# EAGLE design seitanclock (EAGLE 7.7.0)
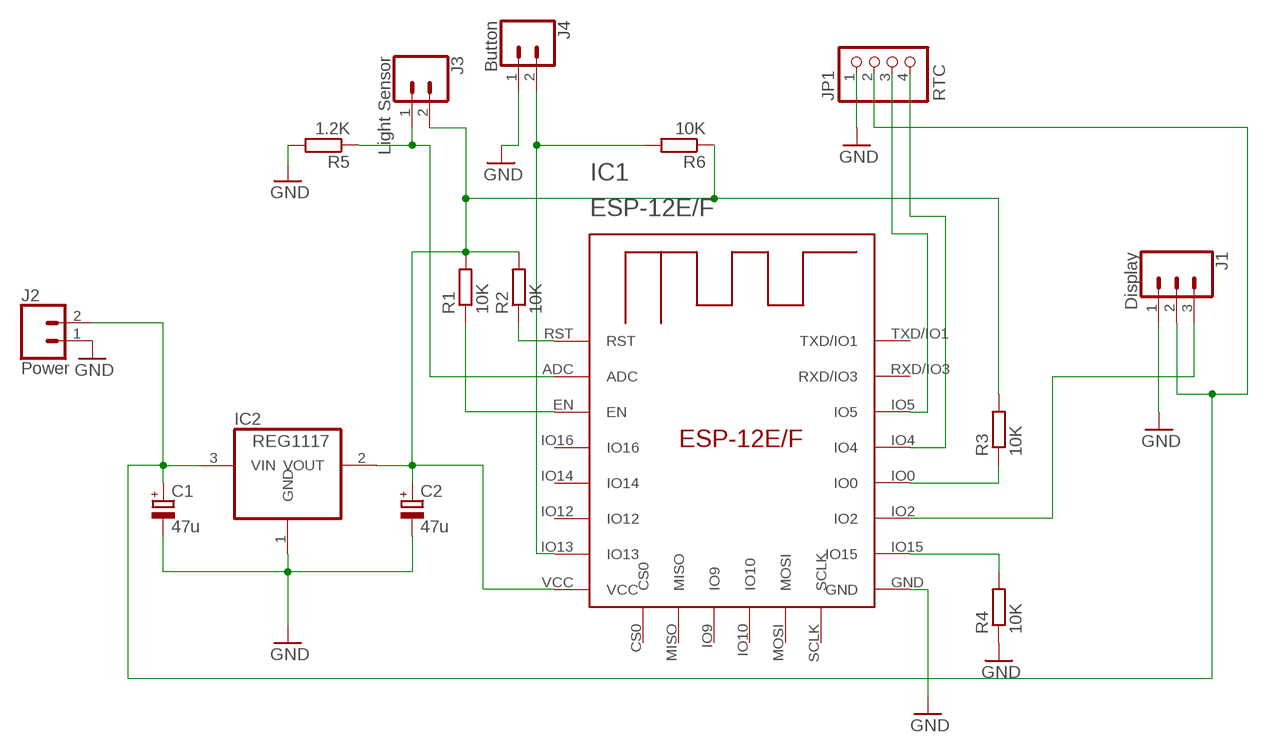
[diagram p0: schematic, sheet 1]

## Parts
C1  47u  CPOL-EU153CLV-0605  [153CLV-0605]
C2  47u  CPOL-EU153CLV-0605  [153CLV-0605]
IC1  ESP-12E/F  [ESP-12E]
IC2  REG1117  [SOT223]
J1  Display  CONN_03POLAR  [MOLEX-1X3]
J2  Power  CONN_02POLAR  [MOLEX-1X2]
J3  Light Sensor  CONN_02POLAR  [MOLEX-1X2]
J4  Button  CONN_02POLAR  [MOLEX-1X2]
JP1  RTC  PINHD-1X4  [1X04]
R1  10K  R-EU_R1206  [R1206]
R2  10K  R-EU_R1206  [R1206]
R3  10K  R-EU_R1206  [R1206]
R4  10K  R-EU_R1206  [R1206]
R5  1.2K  R-EU_R1206  [R1206]
R6  10K  R-EU_R1206  [R1206]

## Nets
GND: C1.- C2.- IC1.GND IC2.1(GND) J1.1 J2.1 J4.1 JP1.1 R4.1 R5.2
N$2: IC1.IO5 JP1.3
N$3: IC1.EN R1.1
N$4: IC1.RST R2.1
N$5: C2.+ IC1.VCC IC2.2(VOUT) J3.2 R1.2 R2.2 R3.2 R6.1
N$6: IC1.IO15 R4.2
N$7: IC1.IO0 R3.1
N$8: IC1.IO4 JP1.4
N$9: IC1.ADC J3.1 R5.1
N$10: IC1.IO2 J1.3
N$11: IC1.IO13 J4.2 R6.2
N$12: C1.+ IC2.3(VIN) J1.2 J2.2 JP1.2
Unconnected: IC1.CS0 IC1.IO9 IC1.IO10 IC1.IO12 IC1.IO14 IC1.IO16 IC1.MISO IC1.MOSI IC1.RXD/IO3 IC1.SCLK IC1.TXD/IO1

## Library data of the parts
C1 C2 = rcl:CPOL-EU: POLARIZED CAPACITOR, European symbol
IC1 = esp-12e-f:ESP-12E/F
IC2 = burr-brown:REG1117: 800mA and 1A Low Dropout (LDO) Positive Regulator 1.8V, 2.5V, 2.85V, 3.3V, 5V, and Adj; MPN: REG1117; OC_FARNELL: 1097566; OC_NEWARK: 14P6981
J1 = SparkFun-Connectors:CONN_03: Multi connection point. Often used as Generic Header-pin footprint for 0.1 inch spaced/style header connections On any of the 0.1 inch spaced packages, you can populate with these: Break Away Headers - Straight <https://www.sparkfun.com/products/116> (PRT-00116) Break Away Male Headers - Right Angle <https://www.sparkfun.com/products/553> (PRT-00553) Female Headers <https://www.sparkfun.com/products/115> (PRT-00115) Break Away Headers - Machine Pin <https://www.sparkfun.com/products/117> (PRT-00117) Break Away Female Headers - Swiss Machine Pin <https://www.sparkfun.com/products/743> (PRT-00743) Stackable Header - 3 Pin (Female, 0.1") <https://www.sparkfun.com/products/13875> (PRT-13875) For SCREWTERMINALS and SPRING TERMINALS visit here: Screw Terimnals on SparkFun.com <https://www.sparkfun.com/search/results?term=Screw+Terminals> (5mm/3.5mm/2.54mm spacing) This device is also useful as a general connection point to wire up your design to another part of your project. Our various solder wires solder well into these plated through hole pads. Hook-Up Wire - Assortment (Stranded, 22 AWG) <https://www.sparkfun.com/products/11375> (PRT-11375) Hook-Up Wire - Assortment (Solid Core, 22 AWG) <https://www.sparkfun.com/products/11367> (PRT-11367) View the entire wire category on our website here <https://www.sparkfun.com/categories/141> Special notes: Molex polarized connector foot print use with SKU : PRT-08232 with associated crimp pins and housings.; PROD_ID: CONN-08625; SF_ID: PRT-08096
J2-J4 = SparkFun-Connectors:CONN_02: Multi connection point. Often used as Generic Header-pin footprint for 0.1 inch spaced/style header connections On any of the 0.1 inch spaced packages, you can populate with these: Break Away Headers - Straight <https://www.sparkfun.com/products/116> (PRT-00116) Break Away Male Headers - Right Angle <https://www.sparkfun.com/products/553> (PRT-00553) Female Headers <https://www.sparkfun.com/products/115> (PRT-00115) Break Away Headers - Machine Pin <https://www.sparkfun.com/products/117> (PRT-00117) Break Away Female Headers - Swiss Machine Pin <https://www.sparkfun.com/products/743> (PRT-00743) For SCREWTERMINALS and SPRING TERMINALS visit here: Screw Terimnals on SparkFun.com <https://www.sparkfun.com/search/results?term=Screw+Terminals> (5mm/3.5mm/2.54mm spacing) This device is also useful as a general connection point to wire up your design to another part of your project. Our various solder wires solder well into these plated through hole pads. Hook-Up Wire - Assortment (Stranded, 22 AWG) <https://www.sparkfun.com/products/11375> (PRT-11375) Hook-Up Wire - Assortment (Solid Core, 22 AWG) <https://www.sparkfun.com/products/11367> (PRT-11367) View the entire wire category on our website here <https://www.sparkfun.com/categories/141> Special notes: Molex polarized connector foot print use with: PRT-08233 with associated crimp pins and housings. 2.54_SCREWTERM for use with PRT-10571. 3.5mm Screw Terminal footprints for PRT-08084 5mm Screw Terminal footprints for use with PRT-08432; SF_ID: PRT-09918
JP1 = pinhead:PINHD-1X4: PIN HEADER
R1-R6 = rcl:R-EU_: RESISTOR, European symbol

## Board
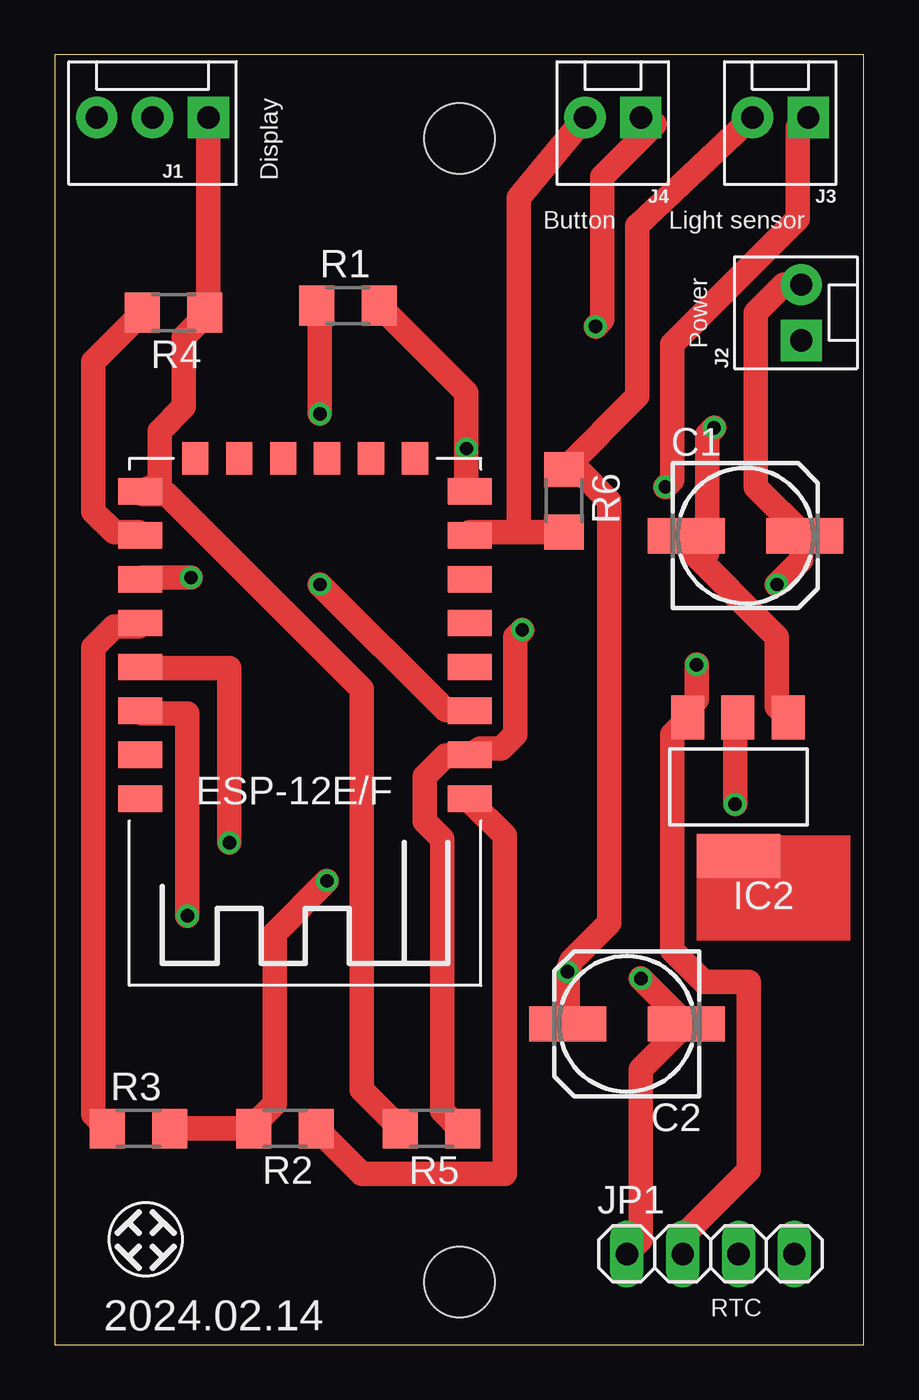
[diagram p1: board, top side]
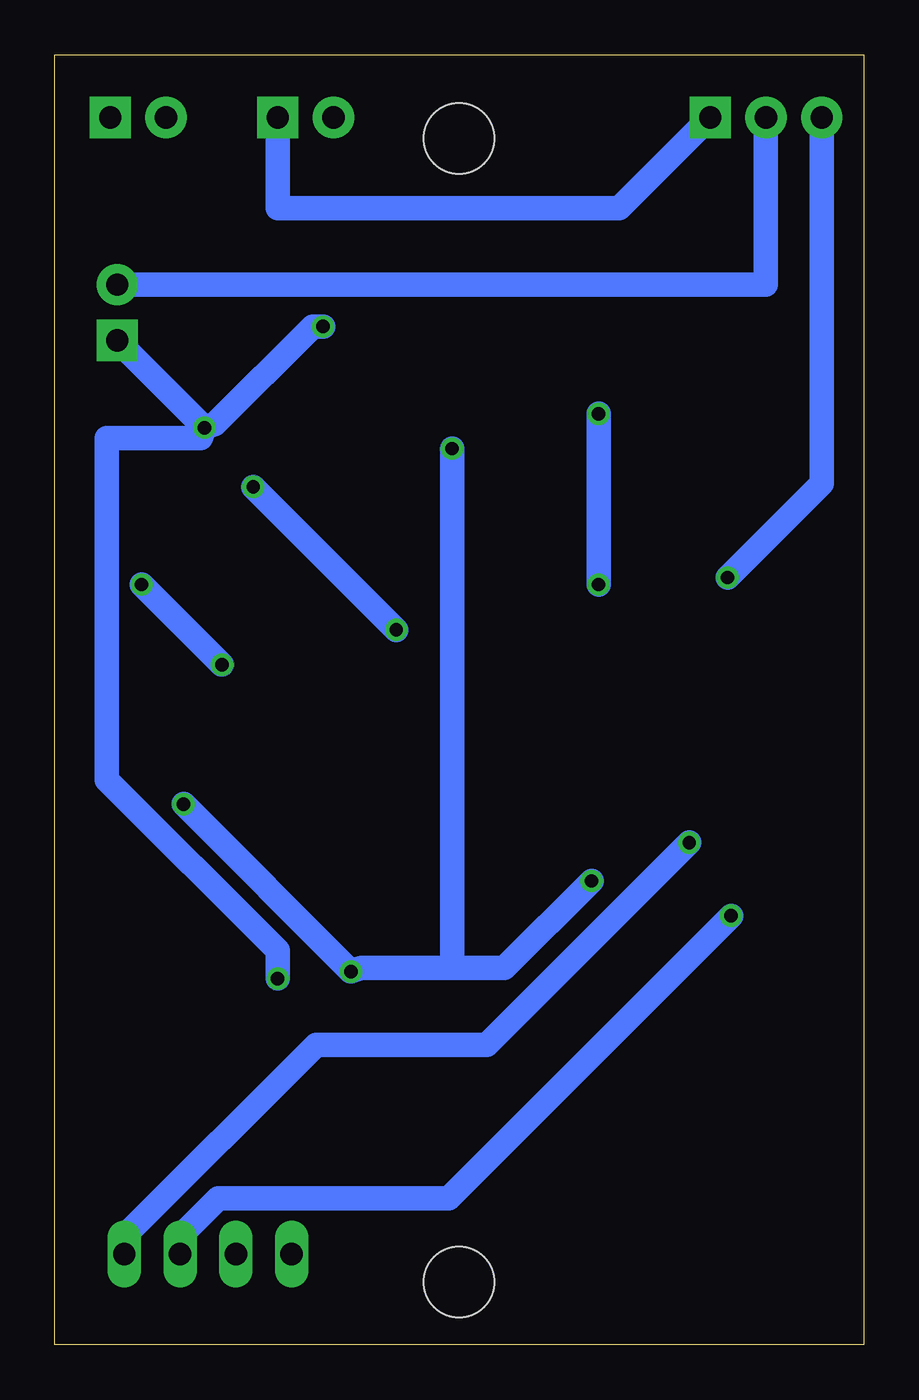
[diagram p2: board, bottom side, seen from below]

Size 36.81 x 58.73 mm. Coordinates in mm from the lower left corner, seen from the top.
Outline: 0,0 36.81,0 36.81,58.73 0,58.73 0,0
Copper layers (1*16): Top 0.035mm / dielectric 1.5mm / Bottom 0.035mm
Design rules "default *": minimum track width 44mil, minimum drill 24mil, track to track 18mil, track to pad 18mil, pad to pad 18mil, via to via 8mil, smd to smd 8mil, copper to edge 40mil, drill to drill 8mil, minimum pad ring 10mil, minimum via ring 8mil, stop-mask expansion 4mil, vias tented up to drill 0mil, thermal gap 10mil
Holes 3.2 mm at 18.41,54.93 18.41,2.86

### Footprints (pad centres in the part's own frame; a part is rotated, then mirrored left to right if it is on the bottom)
153CLV-0605 = smd 3.5 x 1.6: + 2.7,0; - -2.7,0
ESP-12E = smd 2 x 1.2: ADC -7.46,5.53; EN -7.46,3.53; GND 7.54,-6.47; IO0 7.54,-0.47; IO2 7.54,-2.47; IO4 7.54,1.53; IO5 7.54,3.53; IO12 -7.46,-2.47; IO13 -7.46,-4.47; IO14 -7.46,-0.47; IO15 7.54,-4.47; IO16 -7.46,1.53; RST -7.46,7.53; RXD/IO3 7.54,5.53; TXD/IO1 7.54,7.53; VCC -7.46,-6.47 | smd 1.2 x 1.5: CS0 -4.96,-7.97; IO9 -0.96,-7.97; IO10 1.04,-7.97; MISO -2.96,-7.97; MOSI 3.04,-7.97; SCLK 5.04,-7.97
SOT223 = smd 1.499 x 2.007: 1 -2.261,-3.15; 2 0.025,-3.15; 3 2.311,-3.15 | smd 3.81 x 2.007: 4 0,3.15
MOLEX-1X3 = drill 1.016 pad 1.88 square: 1 0,0 | drill 1.016 pad 1.88: 2 2.54,0; 3 5.08,0
MOLEX-1X2 = drill 1.016 pad 1.88 square: 1 0,0 | drill 1.016 pad 1.88: 2 2.54,0
1X04 = drill 1.016 long: 1 -3.81,0; 2 -1.27,0; 3 1.27,0; 4 3.81,0
R1206 = smd 1.6 x 1.803: 1 -1.422,0; 2 1.422,0

### Placement (x,y rotation side)
C1  31.43,36.83 0 top
C2  26.04,14.61 180 top
IC1  11.43,32.39 180 top
IC2  31.11,25.4 180 top
J1  6.99,55.88 180 top
J2  33.97,45.72 90 top
J3  34.29,55.88 180 top
J4  26.67,55.88 180 top
JP1  29.84,4.13 0 top
R1  13.34,47.31 0 top
R2  10.48,9.84 180 top
R3  3.81,9.84 0 top
R4  5.4,46.99 180 top
R5  17.14,9.84 180 top
R6  23.18,38.42 270 top
U$1  [SEITAN_TNAME]  4.76,4.13 0 top

### Tracks (layer width: path | path; a pad name or v marks a point on that pad's centre or on a via)
GND  (via drill 0.61)
  Top 1.118: JP1.1 26.67,4.76 26.67,12.54 C2.- 28.42,14.92 v26.67,16.67 | IC2.1 33.34,28.58 32.86,29.05 32.86,32.23 28.73,36.35 C1.- 29.69,36.04 29.69,41.43 v30,41.75 | J1.1 6.99,47.15 R4.1 6.51,46.51 5.87,45.88 5.87,42.7 4.76,41.59 4.76,39.21 IC1.GND 3.97,38.73 5.08,38.73 13.97,29.84 13.97,11.59 R5.2 | v24.61,46.36 24.92,46.67 24.92,53.18 27.3,55.56 J4.1
  Bottom 1.118: v30,41.75 J2.1 | v26.67,16.67 26.67,17.94 34.45,25.72 34.45,41.28 30.16,41.28 v30,41.75 | J4.1 26.67,51.75 11.11,51.75 J1.1 | v24.61,46.36 25.08,46.36 29.53,41.91 v30,41.75
N$2  (via drill 0.61)
  Top 1.118: v6.03,19.53 6.03,28.73 3.97,28.73 IC1.IO5
  Bottom 1.118: v6.03,19.53 18.89,6.67 29.37,6.67 31.11,4.92 JP1.3
N$3  (via drill 0.61)
  Top 1.118: v12.06,42.39 12.06,47.31 R1.1 | v12.06,34.61 17.78,28.89 18.73,28.89 IC1.EN
  Bottom 1.118: v12.06,34.61 v12.06,42.39
N$4
  Top 1.118: R2.1 13.97,7.78 20.48,7.78 20.48,23.18 18.89,24.77 IC1.RST
N$5  (via drill 0.61)
  Top 1.118: J3.2 26.51,50.96 26.51,43.18 23.18,39.85 R6.1 23.81,39.85 25.24,38.42 25.24,19.21 23.5,17.46 v23.34,16.99 C2.+ | R1.2 18.73,43.34 v18.73,40.8 18.73,38.89 IC1.VCC | R3.2 R2.2 9.37,10.32 10,10.95 10,18.73 v12.38,21.11 | v30.96,24.61 30.96,28.42 IC2.2
  Bottom 1.118: v30.96,24.61 v23.34,16.99 22.86,17.15 18.73,17.15 | v12.38,21.11 16.35,17.15 18.73,17.15 | 18.73,17.15 v18.73,40.8
N$6
  Top 1.118: R4.2 3.97,46.99 1.75,44.77 1.75,37.94 2.7,36.99 3.81,36.99 IC1.IO15
N$7
  Top 1.118: R3.1 1.75,10.48 1.75,31.75 2.7,32.7 3.81,32.7 IC1.IO0
N$8  (via drill 0.61)
  Top 1.118: v7.94,22.86 7.94,30.8 3.97,30.8 IC1.IO4
  Bottom 1.118: v7.94,22.86 17.14,13.65 24.92,13.65 33.66,4.92 JP1.4
N$9  (via drill 0.61)
  Top 1.118: R5.1 18.41,9.84 17.62,10.64 17.62,23.02 16.83,23.81 16.83,25.88 17.78,26.83 18.73,26.83 IC1.ADC 19.37,27.15 20.32,27.15 20.95,27.78 20.95,32.23 v21.27,32.54 | J3.1 33.81,55.4 33.81,51.28 28.1,45.56 28.1,39.37 v27.78,39.05
  Bottom 1.118: v21.27,32.54 v27.78,39.05
N$10  (via drill 0.61)
  Top 1.118: v6.19,34.92 3.97,34.92 IC1.IO2
  Bottom 1.118: v6.19,34.92 1.91,39.21 J1.3
N$11
  Top 1.118: 21.11,36.99 18.89,36.99 IC1.IO13 | 21.11,36.99 R6.2 | 21.11,36.99 21.11,52.23 J4.2
N$12  (via drill 0.61)
  Top 1.118: JP1.2 28.57,4.92 31.59,7.94 31.59,16.51 29.53,16.51 28.1,17.94 28.1,27.78 28.73,28.42 IC2.3 28.89,29.05 29.21,29.37 v29.21,30.96 | J2.2 33.18,48.26 31.91,46.99 31.91,39.05 C1.+ 33.97,36.35 33.97,35.72 v32.86,34.61
  Bottom 1.118: J1.2 4.45,48.26 J2.2 | v32.86,34.61 v29.21,30.96
(copper drawn outside any net)
  shapes: Top area x1

### Text on the board
tPlace: 2024.02.14
tNames: Display | Button | Light sensor | Power | RTC